# EasyEDA Pro project ProPrj_MaNFCKeyRing_2026-02-08.epro

# Board MaKeyRing
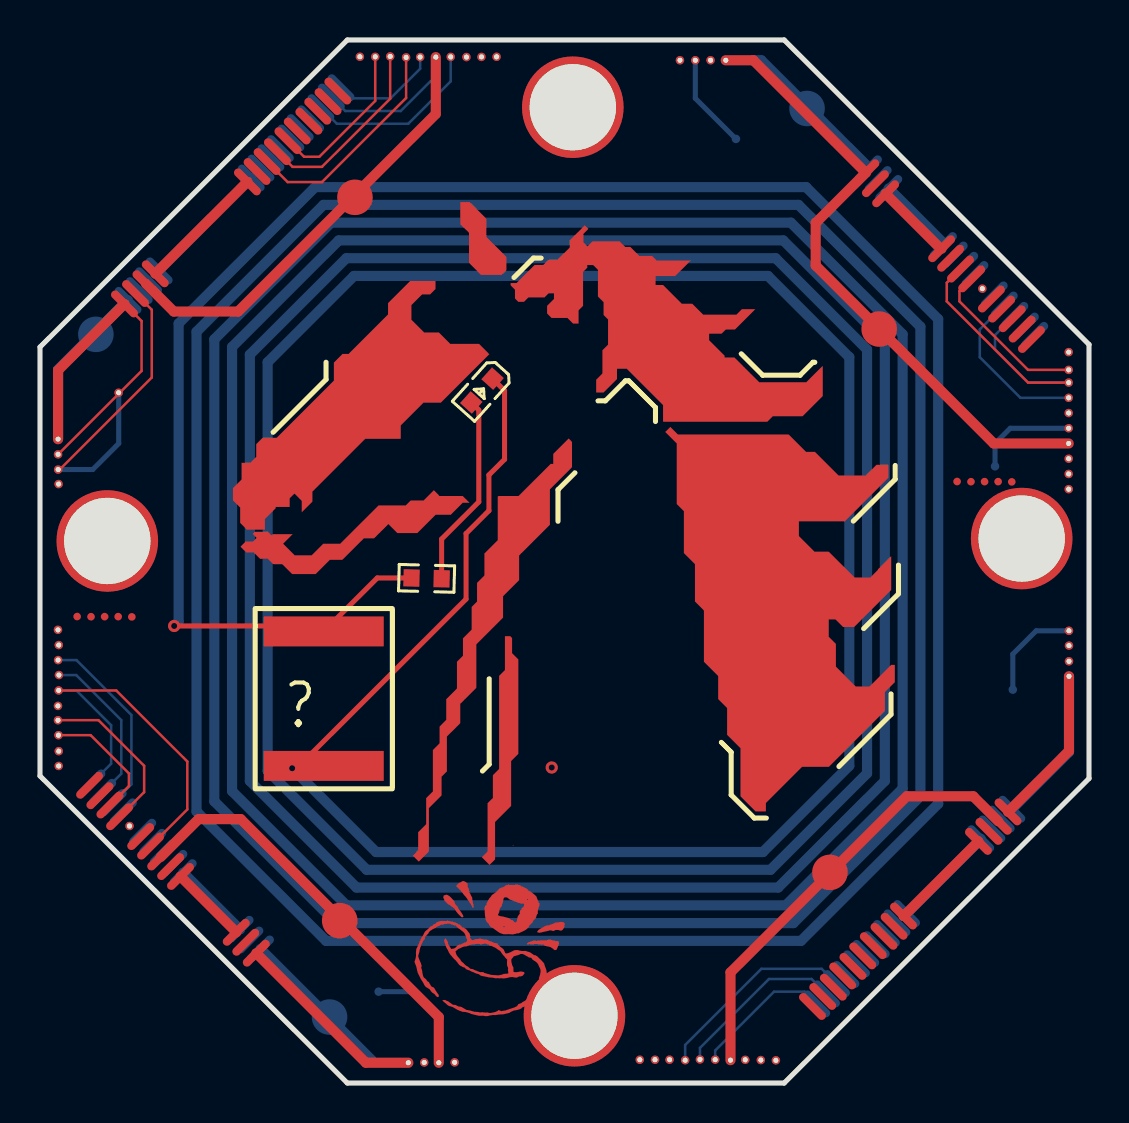
[diagram p0: board, top side]
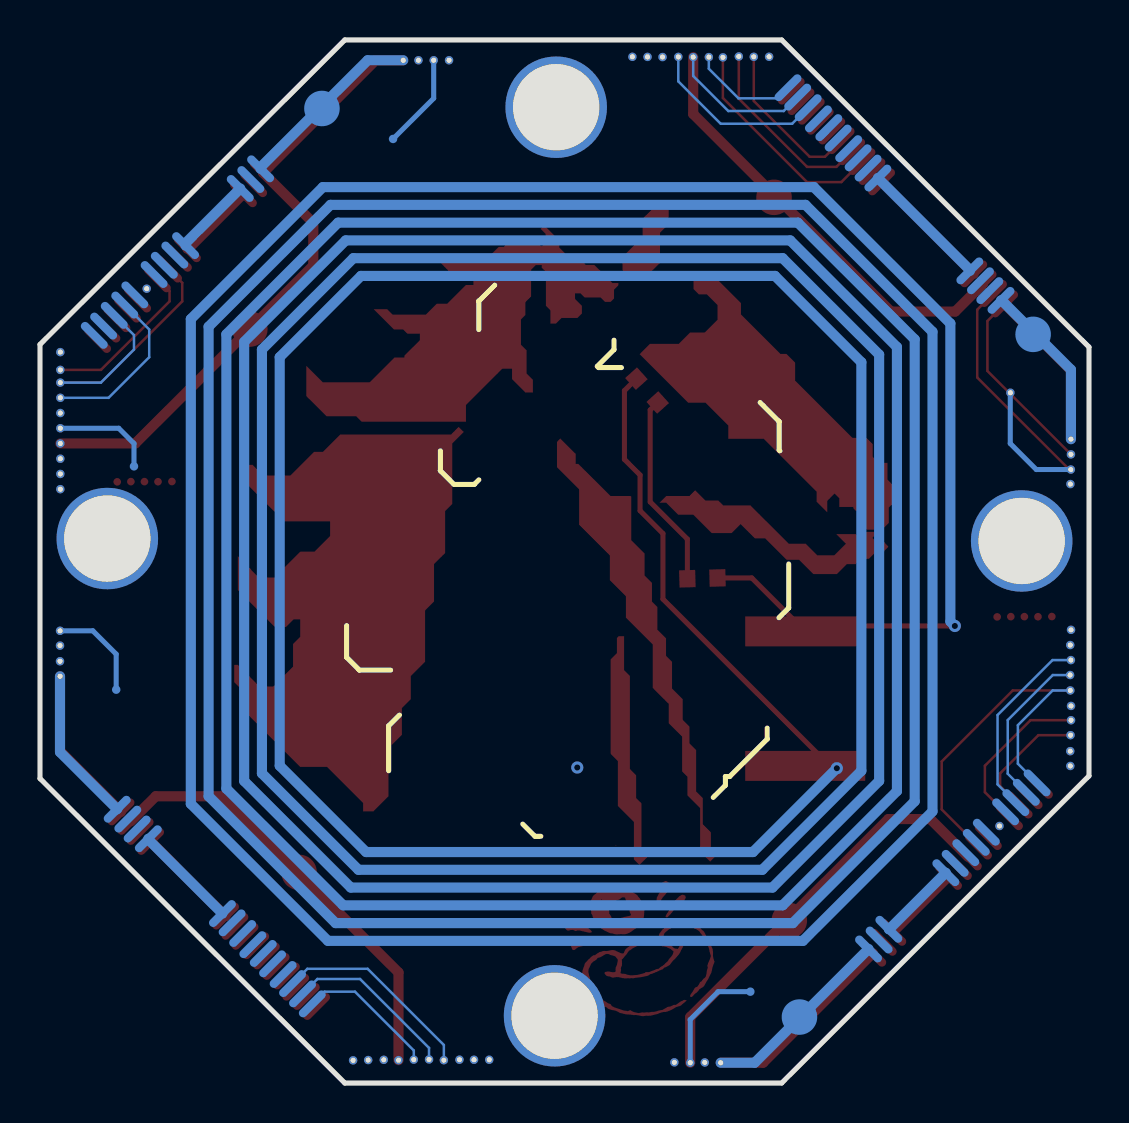
[diagram p1: board, bottom side, seen from below]

Outline 52.45 x 52.2 mm; copper layers: Top Layer, Bottom Layer. Coordinates in mm from the lower left corner of the outline.
Outline path: 0,36.83 15.37,52.2 37.21,52.2 52.45,36.96 52.45,15.24 37.21,0 15.37,0 0,15.37 0,36.83
Stack: Top Layer 0.035mm / Dielectric1 1.51mm FR4 er 4.5 / Bottom Layer 0.035mm

## Design rules (mm)
spacing copperThickness1oz (default): track to track 0.102, other pairs 0.152 to 0.3
spacing copperThickness2oz: track to track 0.203, other pairs 0.152 to 0.3
spacing Plane_innerPlane: track to track 0.102, other pairs 0.152 to 0.3
spacing Copper_copperRegion: track to track 0.102, other pairs 0.152 to 0.3
track width copperThickness1oz (default): min 0.127, default 0.254, max 2.54
track width copperThickness2oz: min 0.203, default 0.254, max 2.54
differential pair differentialPair (default): width min 0.127, default 0.254, max 2.54; gap min 0.152, default 0.152

## Placement (name value [footprint] x y rotation side)
LED1  NCD0603R1  [LED0603-RD_RED]  22.1 34.65 228 top
NOREF  -  [Pad_e176]  35.26 1.16 45 top
NOREF#2  -  [Pad_e13]  2.48 14.9 135 top
NOREF#3  -  [Pad_e131]  48.59 13.7 45 top
NOREF#4  -  [Pad_e66]  47.23 30.1 45 top
NOREF#5  -  [Pad_e20]  4.22 38.99 45 top
NOREF#6  -  [Pad_e139]  0.9 31.46 45 top
NOREF#7  -  [Pad_e60]  45.53 41.27 315 top
NOREF#8  -  [Pad_e33]  10.81 6.5 135 top
NOREF#9  -  [Pad_e105]  14.48 3.3 45 top
NOREF#10  -  [Pad_e22]  4.78 39.51 45 top
NOREF#11  -  [Pad_e16]  3.23 23.34 45 top
NOREF#12  -  [Pad_e157]  19.21 1.03 45 top
NOREF#13  -  [Pad_e68]  47.57 39.23 315 top
NOREF#14  -  [Pad_e171]  33 1.18 45 top
NOREF#15  -  [Pad_e196]  37.15 23.21 0 top
NOREF#16  -  [Pad_e191]  51.45 21.11 45 top
NOREF#17  -  [Pad_e159]  19.94 1.02 45 top
NOREF#18  -  [Pad_e115]  41.42 45.75 135 top
NOREF#19  -  [Pad_e118]  42.32 7.48 45 top
NOREF#20  -  [Pad_e162]  21.32 51.34 45 top
NOREF#21  -  [Pad_e158]  19.79 51.34 45 top
NOREF#22  -  [Pad_e30]  9.81 7.54 135 top
NOREF#23  -  [Pad_e72]  48.4 13.57 45 top
NOREF#24  -  [Pad_e55]  42.2 7.34 45 top
NOREF#25  -  [Pad_e99]  11.54 46.3 45 top
NOREF#26  -  [Pad_e42]  14.89 49.64 45 top
NOREF#27  -  [Pad_e145]  0.93 15.87 45 top
NOREF#28  -  [Pad_e192]  51.45 20.35 45 top
NOREF#29  -  [Pad_e8]  34.8 47.24 45 top
NOREF#30  -  [Pad_e57]  42.71 7.84 45 top
NOREF#31  -  [Pad_e25]  5.53 11.86 135 top
NOREF#32  -  [Pad_e179]  47.12 39.75 45 top
NOREF#33  -  [Pad_e97]  11.02 6.71 135 top
NOREF#34  -  [Pad_e199]  16.06 34.57 0 top
NOREF#35  -  [Pad_e135]  0.9 22.68 45 top
NOREF#36  -  [Pad_e124]  46.24 40.92 135 top
NOREF#37  -  [Pad_e26]  5.76 40.5 45 top
NOREF#38  -  [Pad_e82]  3.13 14.55 135 top
NOREF#39  -  [Pad_e27]  6.03 11.31 135 top
NOREF#40  -  [Pad_e41]  14.4 49.11 45 top
NOREF#41  -  [Pad_e153]  17.51 51.37 45 top
NOREF#42  -  [Pad_e184]  51.44 35.69 45 top
NOREF#43  -  [Pad_e34]  10.86 45.61 45 top
NOREF#44  -  [Pad_e11]  16.93 4.57 45 top
NOREF#45  -  [Pad_e193]  51.45 21.89 45 top
NOREF#46  -  [Pad_e187]  51.44 31.24 45 top
NOREF#47  -  [Pad_e89]  5.64 12.05 135 top
NOREF#48  -  [Pad_e6]  26.64 48.83 45 top
NOREF#49  -  [Pad_e200]  15.76 27.28 0 top
NOREF#50  -  [Pad_e108]  38.35 48.77 45 top
NOREF#51  -  [Pad_e53]  41.67 6.87 45 top
NOREF#52  -  [Pad_e28]  6.53 10.83 135 top
NOREF#53  -  [Pad_e69]  47.91 30.1 45 top
NOREF#54  -  [Pad_e123]  45.71 41.44 135 top
NOREF#55  -  [Pad_e24]  5.3 40 45 top
NOREF#56  -  [Pad_e169]  32.26 1.14 45 top
NOREF#57  -  [Pad_e137]  0.9 18.87 45 top
NOREF#58  -  [Pad_e86]  4.96 39.65 45 top
NOREF#59  -  [Pad_e185]  51.44 36.58 45 top
NOREF#60  -  [Pad_e168]  32 51.18 45 top
NOREF#61  -  [Pad_e70]  47.91 13.1 45 top
NOREF#62  -  [Pad_e10]  48.64 19.69 45 top
NOREF#63  -  [Pad_e173]  33.76 1.17 45 top
NOREF#64  -  [Pad_e101]  12.54 47.29 45 top
NOREF#65  -  [Pad_e23]  5.04 12.33 135 top
NOREF#66  -  [Pad_e134]  49.74 37.41 135 top
NOREF#67  -  [Pad_e17]  3.5 13.91 135 top
NOREF#68  -  [Pad_e194]  21.93 42.26 0 top
NOREF#69  -  [Pad_e84]  4.17 13.57 135 top
NOREF#70  -  [Pad_e188]  51.44 30.48 45 top
NOREF#71  -  [Pad_e136]  0.9 18.16 45 top
NOREF#72  -  [Pad_e190]  51.45 22.63 45 top
NOREF#73  -  [Pad_e167]  31.48 1.17 45 top
NOREF#74  -  [Pad_e15]  3 14.38 135 top
NOREF#75  -  [Pad_e102]  13.01 47.81 45 top
NOREF#76  -  [Pad_e122]  45.17 41.91 135 top
NOREF#77  -  [Pad_e111]  39.82 4.98 45 top
NOREF#78  -  [Pad_e107]  15.05 49.81 45 top
NOREF#79  -  [Pad_e7]  3.37 27.13 135 top
NOREF#80  -  [Pad_e85]  4.4 39.17 45 top
NOREF#81  -  [Pad_e93]  7.16 10.53 135 top
NOREF#82  -  [Pad_e96]  10.56 45.29 45 top
NOREF#83  -  [Pad_e160]  20.53 51.35 45 top
NOREF#84  -  [Pad_e45]  38.62 3.83 45 top
NOREF#85  -  [Pad_e32]  10.37 45.09 45 top
NOREF#86  -  [Pad_e186]  51.44 32 45 top
NOREF#87  -  [Pad_e132]  48.74 38.42 135 top
NOREF#88  -  [Pad_e18]  3.91 23.34 45 top
NOREF#89  -  [Pad_e125]  46.75 40.46 135 top
NOREF#90  -  [Pad_e75]  49.11 37.73 315 top
NOREF#91  -  [Pad_e106]  14.57 49.34 45 top
NOREF#92  -  [Pad_e128]  47.71 39.44 135 top
NOREF#93  -  [Pad_e14]  2.55 23.33 45 top
NOREF#94  -  [Pad_e19]  3.98 13.33 135 top
NOREF#95  -  [Pad_e170]  32.77 51.18 45 top
NOREF#96  -  [Pad_e74]  48.61 38.25 315 top
NOREF#97  -  [Pad_e94]  10.01 7.69 135 top
NOREF#98  -  [Pad_e144]  0.93 19.65 45 top
NOREF#99  -  [Pad_e147]  0.94 21.92 45 top
NOREF#100  -  [Pad_e47]  39.5 10.54 45 top
NOREF#101  -  [Pad_e50]  40.65 5.84 45 top
NOREF#102  -  [Pad_e63]  46.55 30.09 45 top
NOREF#103  -  [Pad_e104]  14.04 48.81 45 top
NOREF#104  -  [Pad_e29]  7.03 10.34 135 top
NOREF#105  -  [Pad_e56]  42.28 44.5 315 top
NOREF#106  -  [Pad_e141]  0.91 30.7 45 top
NOREF#107  -  [Pad_e112]  40.3 5.43 45 top
NOREF#108  -  [Pad_e4]  26.72 3.37 225 top
NOREF#109  -  [Pad_e148]  0.95 20.42 45 top
NOREF#110  -  [Pad_e129]  48.06 13.21 45 top
NOREF#111  -  [Pad_e77]  41.96 37.73 45 top
NOREF#112  -  [Pad_e143]  0.93 29.97 45 top
NOREF#113  -  [Pad_e48]  39.67 4.8 45 top
NOREF#114  -  [Pad_e98]  11.05 45.79 45 top
NOREF#115  -  [Pad_e35]  11.35 46.11 45 top
NOREF#116  -  [Pad_e197]  23.44 16.64 0 top
NOREF#117  -  [Pad_e40]  13.89 48.63 45 top
NOREF#118  -  [Pad_e156]  19.01 51.34 45 top
NOREF#119  -  [Pad_e161]  20.73 1.03 45 top
NOREF#120  -  [Pad_e87]  5.13 12.55 135 top
NOREF#121  -  [Pad_e43]  14.99 8.13 45 top
NOREF#122  -  [Pad_e181]  51.44 33.53 45 top
NOREF#123  -  [Pad_e71]  48.08 38.73 315 top
NOREF#124  -  [Pad_e52]  41.29 45.55 315 top
NOREF#125  -  [Pad_e121]  43.33 8.48 45 top
NOREF#126  -  [Pad_e80]  2.59 15.02 135 top
NOREF#127  -  [Pad_e140]  0.91 21.16 45 top
NOREF#128  -  [Pad_e180]  51.44 32.77 45 top
NOREF#129  -  [Pad_e109]  38.84 3.96 45 top
NOREF#130  -  [Pad_e150]  4.48 12.86 45 top
NOREF#131  -  [Pad_e58]  43.18 8.36 45 top
NOREF#132  -  [Pad_e88]  5.43 40.15 45 top
NOREF#133  -  [Pad_e65]  46.92 12.09 45 top
NOREF#134  -  [Pad_e166]  30.75 1.17 45 top
NOREF#135  -  [Pad_e100]  12.02 46.76 45 top
NOREF#136  -  [Pad_e152]  16.76 51.35 45 top
NOREF#137  -  [Pad_e83]  3.66 14.03 135 top
NOREF#138  -  [Pad_e49]  40.13 5.36 45 top
NOREF#139  -  [Pad_e198]  21.48 21.67 0 top
NOREF#140  -  [Pad_e149]  3.93 34.54 45 top
NOREF#141  -  [Pad_e73]  48.59 30.08 45 top
NOREF#142  -  [Pad_e110]  39.32 4.46 45 top
NOREF#143  -  [Pad_e59]  45.08 41.75 315 top
NOREF#144  -  [Pad_e163]  22.07 51.35 45 top
NOREF#145  -  [Pad_e138]  0.9 32.22 45 top
NOREF#146  -  [Pad_e113]  40.82 5.96 45 top
NOREF#147  -  [Pad_e172]  33.53 51.18 45 top
NOREF#148  -  [Pad_e78]  14.19 15.87 180 top
NOREF#149  -  [Pad_e182]  51.44 34.29 45 top
NOREF#150  -  [Pad_e90]  5.96 40.64 45 top
NOREF#151  -  [Pad_e61]  45.86 30.1 45 top
NOREF#152  -  [Pad_e174]  34.29 51.18 45 top
NOREF#153  -  [Pad_e114]  41.29 6.48 45 top
NOREF#154  -  [Pad_e39]  13.44 48.13 45 top
NOREF#155  -  [Pad_e151]  16 51.36 45 top
NOREF#156  -  [Pad_e130]  48.21 38.93 135 top
NOREF#157  -  [Pad_e183]  51.44 35.05 45 top
NOREF#158  -  [Pad_e64]  46.58 40.24 315 top
NOREF#159  -  [Pad_e38]  12.86 47.64 45 top
NOREF#160  -  [Pad_e91]  6.16 11.53 135 top
NOREF#161  -  [Pad_e116]  41.81 6.92 45 top
NOREF#162  -  [Pad_e92]  6.69 10.99 135 top
NOREF#163  -  [Pad_e126]  47.03 12.23 45 top
NOREF#164  -  [Pad_e81]  2.79 37.47 45 top
NOREF#165  -  [Pad_e46]  39.14 4.33 45 top
NOREF#166  -  [Pad_e165]  29.99 1.17 45 top
NOREF#167  -  [Pad_e154]  18.31 51.33 45 top
NOREF#168  -  [Pad_e117]  41.91 45.21 135 top
NOREF#169  -  [Pad_e36]  11.87 46.61 45 top
NOREF#170  -  [Pad_e21]  4.59 23.33 45 top
NOREF#171  -  [Pad_e44]  15.75 44.32 45 top
NOREF#172  -  [Pad_e189]  51.44 29.72 45 top
NOREF#173  -  [Pad_e67]  47.45 12.59 45 top
NOREF#174  -  [Pad_e103]  13.53 48.25 45 top
NOREF#175  -  [Pad_e62]  46.02 40.73 315 top
NOREF#176  -  [Pad_e127]  47.59 12.71 45 top
NOREF#177  -  [Pad_e54]  41.77 45 315 top
NOREF#178  -  [Pad_e175]  34.53 1.14 45 top
NOREF#179  -  [Pad_e142]  0.92 17.41 45 top
NOREF#180  -  [Pad_e37]  12.4 47.16 45 top
NOREF#181  -  [Pad_e79]  14.19 22.6 180 top
NOREF#182  -  [Pad_e9]  47.75 30.86 45 top
NOREF#183  -  [Pad_e120]  42.84 8.02 45 top
NOREF#184  -  [Pad_e146]  0.94 16.61 45 top
NOREF#185  -  [Pad_e76]  49.57 37.21 315 top
NOREF#186  -  [Pad_e51]  41.14 6.36 45 top
NOREF#187  -  [Pad_e119]  42.44 44.77 135 top
NOREF#188  -  [Pad_e12]  1.86 23.34 45 top
NOREF#189  -  [Pad_e195]  31.33 40.77 0 top
NOREF#190  -  [Pad_e155]  18.41 1.02 45 top
NOREF#191  -  [Pad_e177]  36.04 1.15 45 top
NOREF#192  -  [Pad_e133]  49.27 37.88 135 top
NOREF#193  -  [Pad_e5]  49.09 27.25 315 top
NOREF#194  -  [Pad_e178]  36.8 1.14 45 top
NOREF#195  -  [Pad_e95]  10.49 7.16 135 top
NOREF#196  -  [Pad_e164]  22.83 51.35 45 top
NOREF#197  -  [Pad_e31]  10.29 7.04 135 top
R1  10kΩ  [R0603]  19.33 25.25 178.5 top

## Footprints (pads in the part's own frame, mm; a bottom-side part is the same pattern mirrored in y, then rotated)
LED0603-RD_RED
  rect 0.8x0.8 smd: 1(-0.8,-0.004) 2(0.8,0.004)
Pad_e4
  round 5.08 hole 4.318: 1(0,0)
Pad_e5
  round 5.08 hole 4.318: 1(0,0)
Pad_e6
  round 5.08 hole 4.318: 1(0,0)
Pad_e7
  round 5.08 hole 4.318: 1(0,0)
Pad_e8
  round 0.423 smd far side: 1(0,0)
Pad_e9
  round 0.423 smd far side: 1(0,0)
Pad_e10
  round 0.423 smd far side: 1(0,0)
Pad_e11
  round 0.423 smd far side: 1(0,0)
Pad_e12
  round 0.381 smd: 1(0,0)
Pad_e13
  oval 0.423x1.728 smd: 1(0,0)
Pad_e14
  round 0.381 smd: 1(0,0)
Pad_e15
  oval 0.423x1.728 smd: 1(0,0)
Pad_e16
  round 0.381 smd: 1(0,0)
Pad_e17
  oval 0.423x1.728 smd: 1(0,0)
Pad_e18
  round 0.381 smd: 1(0,0)
Pad_e19
  oval 0.423x1.728 smd: 1(0,0)
Pad_e20
  oval 0.423x1.728 smd: 1(0,0)
Pad_e21
  round 0.381 smd: 1(0,0)
Pad_e22
  oval 0.423x1.728 smd: 1(0,0)
Pad_e23
  oval 0.423x1.728 smd: 1(0,0)
Pad_e24
  oval 0.423x1.728 smd: 1(0,0)
Pad_e25
  oval 0.423x1.728 smd: 1(0,0)
Pad_e26
  oval 0.423x1.728 smd: 1(0,0)
Pad_e27
  oval 0.423x1.728 smd: 1(0,0)
Pad_e28
  oval 0.423x1.728 smd: 1(0,0)
Pad_e29
  oval 0.423x1.728 smd: 1(0,0)
Pad_e30
  oval 0.423x1.728 smd: 1(0,0)
Pad_e31
  oval 0.423x1.728 smd: 1(0,0)
Pad_e32
  oval 0.423x1.728 smd: 1(0,0)
Pad_e33
  oval 0.423x1.728 smd: 1(0,0)
Pad_e34
  oval 0.423x1.728 smd: 1(0,0)
Pad_e35
  oval 0.423x1.728 smd: 1(0,0)
Pad_e36
  oval 0.423x1.728 smd: 1(0,0)
Pad_e37
  oval 0.423x1.728 smd: 1(0,0)
Pad_e38
  oval 0.423x1.728 smd: 1(0,0)
Pad_e39
  oval 0.423x1.728 smd: 1(0,0)
Pad_e40
  oval 0.423x1.728 smd: 1(0,0)
Pad_e41
  oval 0.423x1.728 smd: 1(0,0)
Pad_e42
  oval 0.423x1.728 smd: 1(0,0)
Pad_e43
  round 1.778 smd: 1(0,0)
Pad_e44
  round 1.778 smd: 1(0,0)
Pad_e45
  oval 0.423x1.728 smd: 1(0,0)
Pad_e46
  oval 0.423x1.728 smd: 1(0,0)
Pad_e47
  round 1.778 smd: 1(0,0)
Pad_e48
  oval 0.423x1.728 smd: 1(0,0)
Pad_e49
  oval 0.423x1.728 smd: 1(0,0)
Pad_e50
  oval 0.423x1.728 smd: 1(0,0)
Pad_e51
  oval 0.423x1.728 smd: 1(0,0)
Pad_e52
  oval 0.423x1.728 smd: 1(0,0)
Pad_e53
  oval 0.423x1.728 smd: 1(0,0)
Pad_e54
  oval 0.423x1.728 smd: 1(0,0)
Pad_e55
  oval 0.423x1.728 smd: 1(0,0)
Pad_e56
  oval 0.423x1.728 smd: 1(0,0)
Pad_e57
  oval 0.423x1.728 smd: 1(0,0)
Pad_e58
  oval 0.423x1.728 smd: 1(0,0)
Pad_e59
  oval 0.423x1.728 smd: 1(0,0)
Pad_e60
  oval 0.423x1.728 smd: 1(0,0)
Pad_e61
  round 0.381 smd: 1(0,0)
Pad_e62
  oval 0.423x1.728 smd: 1(0,0)
Pad_e63
  round 0.381 smd: 1(0,0)
Pad_e64
  oval 0.423x1.728 smd: 1(0,0)
Pad_e65
  oval 0.423x1.728 smd: 1(0,0)
Pad_e66
  round 0.381 smd: 1(0,0)
Pad_e67
  oval 0.423x1.728 smd: 1(0,0)
Pad_e68
  oval 0.423x1.728 smd: 1(0,0)
Pad_e69
  round 0.381 smd: 1(0,0)
Pad_e70
  oval 0.423x1.728 smd: 1(0,0)
Pad_e71
  oval 0.423x1.728 smd: 1(0,0)
Pad_e72
  oval 0.423x1.728 smd: 1(0,0)
Pad_e73
  round 0.381 smd: 1(0,0)
Pad_e74
  oval 0.423x1.728 smd: 1(0,0)
Pad_e75
  oval 0.423x1.728 smd: 1(0,0)
Pad_e76
  oval 0.423x1.728 smd: 1(0,0)
Pad_e77
  round 1.778 smd: 1(0,0)
Pad_e78
  rect 6x1.5 smd: 1(0,0)
Pad_e79
  rect 6x1.5 smd: 1(0,0)
Pad_e80
  oval 0.423x1.728 smd far side: 1(0,0)
Pad_e81
  round 1.778 smd far side: 1(0,0)
Pad_e82
  oval 0.423x1.728 smd far side: 1(0,0)
Pad_e83
  oval 0.423x1.728 smd far side: 1(0,0)
Pad_e84
  oval 0.423x1.728 smd far side: 1(0,0)
Pad_e85
  oval 0.423x1.728 smd far side: 1(0,0)
Pad_e86
  oval 0.423x1.728 smd far side: 1(0,0)
Pad_e87
  oval 0.423x1.728 smd far side: 1(0,0)
Pad_e88
  oval 0.423x1.728 smd far side: 1(0,0)
Pad_e89
  oval 0.423x1.728 smd far side: 1(0,0)
Pad_e90
  oval 0.423x1.728 smd far side: 1(0,0)
Pad_e91
  oval 0.423x1.728 smd far side: 1(0,0)
Pad_e92
  oval 0.423x1.728 smd far side: 1(0,0)
Pad_e93
  oval 0.423x1.728 smd far side: 1(0,0)
Pad_e94
  oval 0.423x1.728 smd far side: 1(0,0)
Pad_e95
  oval 0.423x1.728 smd far side: 1(0,0)
Pad_e96
  oval 0.423x1.728 smd far side: 1(0,0)
Pad_e97
  oval 0.423x1.728 smd far side: 1(0,0)
Pad_e98
  oval 0.423x1.728 smd far side: 1(0,0)
Pad_e99
  oval 0.423x1.728 smd far side: 1(0,0)
Pad_e100
  oval 0.423x1.728 smd far side: 1(0,0)
Pad_e101
  oval 0.423x1.728 smd far side: 1(0,0)
Pad_e102
  oval 0.423x1.728 smd far side: 1(0,0)
Pad_e103
  oval 0.423x1.728 smd far side: 1(0,0)
Pad_e104
  oval 0.423x1.728 smd far side: 1(0,0)
Pad_e105
  round 1.778 smd far side: 1(0,0)
Pad_e106
  oval 0.423x1.728 smd far side: 1(0,0)
Pad_e107
  oval 0.423x1.728 smd far side: 1(0,0)
Pad_e108
  round 1.778 smd far side: 1(0,0)
Pad_e109
  oval 0.423x1.728 smd far side: 1(0,0)
Pad_e110
  oval 0.423x1.728 smd far side: 1(0,0)
Pad_e111
  oval 0.423x1.728 smd far side: 1(0,0)
Pad_e112
  oval 0.423x1.728 smd far side: 1(0,0)
Pad_e113
  oval 0.423x1.728 smd far side: 1(0,0)
Pad_e114
  oval 0.423x1.728 smd far side: 1(0,0)
Pad_e115
  oval 0.423x1.728 smd far side: 1(0,0)
Pad_e116
  oval 0.423x1.728 smd far side: 1(0,0)
Pad_e117
  oval 0.423x1.728 smd far side: 1(0,0)
Pad_e118
  oval 0.423x1.728 smd far side: 1(0,0)
Pad_e119
  oval 0.423x1.728 smd far side: 1(0,0)
Pad_e120
  oval 0.423x1.728 smd far side: 1(0,0)
Pad_e121
  oval 0.423x1.728 smd far side: 1(0,0)
Pad_e122
  oval 0.423x1.728 smd far side: 1(0,0)
Pad_e123
  oval 0.423x1.728 smd far side: 1(0,0)
Pad_e124
  oval 0.423x1.728 smd far side: 1(0,0)
Pad_e125
  oval 0.423x1.728 smd far side: 1(0,0)
Pad_e126
  oval 0.423x1.728 smd far side: 1(0,0)
Pad_e127
  oval 0.423x1.728 smd far side: 1(0,0)
Pad_e128
  oval 0.423x1.728 smd far side: 1(0,0)
Pad_e129
  oval 0.423x1.728 smd far side: 1(0,0)
Pad_e130
  oval 0.423x1.728 smd far side: 1(0,0)
Pad_e131
  oval 0.423x1.728 smd far side: 1(0,0)
Pad_e132
  oval 0.423x1.728 smd far side: 1(0,0)
Pad_e133
  oval 0.423x1.728 smd far side: 1(0,0)
Pad_e134
  oval 0.423x1.728 smd far side: 1(0,0)
Pad_e135
  round 0.423 hole 0.254: 1(0,0)
Pad_e136
  round 0.423 hole 0.254: 1(0,0)
Pad_e137
  round 0.423 hole 0.254: 1(0,0)
Pad_e138
  round 0.423 hole 0.254: 1(0,0)
Pad_e139
  round 0.423 hole 0.254: 1(0,0)
Pad_e140
  round 0.423 hole 0.254: 1(0,0)
Pad_e141
  round 0.423 hole 0.254: 1(0,0)
Pad_e142
  round 0.423 hole 0.254: 1(0,0)
Pad_e143
  round 0.423 hole 0.254: 1(0,0)
Pad_e144
  round 0.423 hole 0.254: 1(0,0)
Pad_e145
  round 0.423 hole 0.254: 1(0,0)
Pad_e146
  round 0.423 hole 0.254: 1(0,0)
Pad_e147
  round 0.423 hole 0.254: 1(0,0)
Pad_e148
  round 0.423 hole 0.254: 1(0,0)
Pad_e149
  round 0.423 hole 0.254: 1(0,0)
Pad_e150
  round 0.423 hole 0.254: 1(0,0)
Pad_e151
  round 0.423 hole 0.254: 1(0,0)
Pad_e152
  round 0.423 hole 0.254: 1(0,0)
Pad_e153
  round 0.423 hole 0.254: 1(0,0)
Pad_e154
  round 0.423 hole 0.254: 1(0,0)
Pad_e155
  round 0.423 hole 0.254: 1(0,0)
Pad_e156
  round 0.423 hole 0.254: 1(0,0)
Pad_e157
  round 0.423 hole 0.254: 1(0,0)
Pad_e158
  round 0.423 hole 0.254: 1(0,0)
Pad_e159
  round 0.423 hole 0.254: 1(0,0)
Pad_e160
  round 0.423 hole 0.254: 1(0,0)
Pad_e161
  round 0.423 hole 0.254: 1(0,0)
Pad_e162
  round 0.423 hole 0.254: 1(0,0)
Pad_e163
  round 0.423 hole 0.254: 1(0,0)
Pad_e164
  round 0.423 hole 0.254: 1(0,0)
Pad_e165
  round 0.423 hole 0.254: 1(0,0)
Pad_e166
  round 0.423 hole 0.254: 1(0,0)
Pad_e167
  round 0.423 hole 0.254: 1(0,0)
Pad_e168
  round 0.423 hole 0.254: 1(0,0)
Pad_e169
  round 0.423 hole 0.254: 1(0,0)
Pad_e170
  round 0.423 hole 0.254: 1(0,0)
Pad_e171
  round 0.423 hole 0.254: 1(0,0)
Pad_e172
  round 0.423 hole 0.254: 1(0,0)
Pad_e173
  round 0.423 hole 0.254: 1(0,0)
Pad_e174
  round 0.423 hole 0.254: 1(0,0)
Pad_e175
  round 0.423 hole 0.254: 1(0,0)
Pad_e176
  round 0.423 hole 0.254: 1(0,0)
Pad_e177
  round 0.423 hole 0.254: 1(0,0)
Pad_e178
  round 0.423 hole 0.254: 1(0,0)
Pad_e179
  round 0.423 hole 0.254: 1(0,0)
Pad_e180
  round 0.423 hole 0.254: 1(0,0)
Pad_e181
  round 0.423 hole 0.254: 1(0,0)
Pad_e182
  round 0.423 hole 0.254: 1(0,0)
Pad_e183
  round 0.423 hole 0.254: 1(0,0)
Pad_e184
  round 0.423 hole 0.254: 1(0,0)
Pad_e185
  round 0.423 hole 0.254: 1(0,0)
Pad_e186
  round 0.423 hole 0.254: 1(0,0)
Pad_e187
  round 0.423 hole 0.254: 1(0,0)
Pad_e188
  round 0.423 hole 0.254: 1(0,0)
Pad_e189
  round 0.423 hole 0.254: 1(0,0)
Pad_e190
  round 0.423 hole 0.254: 1(0,0)
Pad_e191
  round 0.423 hole 0.254: 1(0,0)
Pad_e192
  round 0.423 hole 0.254: 1(0,0)
Pad_e193
  round 0.423 hole 0.254: 1(0,0)
Pad_e194
  custom 2.309x3.645 smd: 3(0,0)
Pad_e195
  custom 15.605x9.834 smd: 4(0,0)
Pad_e196
  custom 11.486x19.243 smd: 5(0,0)
Pad_e197
  custom 1.829x11.451 smd: 6(0,0)
Pad_e198
  custom 7.963x21.172 smd: 7(0,0)
Pad_e199
  custom 12.827x12.444 smd: 8(0,0)
Pad_e200
  custom 11.441x4.194 smd: 10(0,0)
R0603
  rect 0.806x0.864 smd: 1(-0.753,0) 2(0.753,0)

## Nets
$1N256: LED1.2 R1.1
$1N261: LED1.1 NOREF#148.1 NOREF#181.1 R1.2

Pads without a net: NOREF 1; NOREF#2 1; NOREF#3 1; NOREF#4 1; NOREF#5 1; NOREF#6 1; NOREF#7 1; NOREF#8 1; NOREF#9 1; NOREF#10 1; NOREF#11 1; NOREF#12 1; NOREF#13 1; NOREF#14 1; NOREF#15 5; NOREF#16 1; NOREF#17 1; NOREF#18 1; NOREF#19 1; NOREF#20 1; NOREF#21 1; NOREF#22 1; NOREF#23 1; NOREF#24 1; NOREF#25 1; NOREF#26 1; NOREF#27 1; NOREF#28 1; NOREF#29 1; NOREF#30 1; NOREF#31 1; NOREF#32 1; NOREF#33 1; NOREF#34 8; NOREF#35 1; NOREF#36 1; NOREF#37 1; NOREF#38 1; NOREF#39 1; NOREF#40 1; NOREF#41 1; NOREF#42 1; NOREF#43 1; NOREF#44 1; NOREF#45 1; NOREF#46 1; NOREF#47 1; NOREF#48 1; NOREF#49 10; NOREF#50 1; NOREF#51 1; NOREF#52 1; NOREF#53 1; NOREF#54 1; NOREF#55 1; NOREF#56 1; NOREF#57 1; NOREF#58 1; NOREF#59 1; NOREF#60 1; NOREF#61 1; NOREF#62 1; NOREF#63 1; NOREF#64 1; NOREF#65 1; NOREF#66 1; NOREF#67 1; NOREF#68 3; NOREF#69 1; NOREF#70 1; NOREF#71 1; NOREF#72 1; NOREF#73 1; NOREF#74 1; NOREF#75 1; NOREF#76 1; NOREF#77 1; NOREF#78 1; NOREF#79 1; NOREF#80 1; NOREF#81 1; NOREF#82 1; NOREF#83 1; NOREF#84 1; NOREF#85 1; NOREF#86 1; NOREF#87 1; NOREF#88 1; NOREF#89 1; NOREF#90 1; NOREF#91 1; NOREF#92 1; NOREF#93 1; NOREF#94 1; NOREF#95 1; NOREF#96 1; NOREF#97 1; NOREF#98 1; NOREF#99 1; NOREF#100 1; NOREF#101 1; NOREF#102 1; NOREF#103 1; NOREF#104 1; NOREF#105 1; NOREF#106 1; NOREF#107 1; NOREF#108 1; NOREF#109 1; NOREF#110 1; NOREF#111 1; NOREF#112 1; NOREF#113 1; NOREF#114 1; NOREF#115 1; NOREF#116 6; NOREF#117 1; NOREF#118 1; NOREF#119 1; NOREF#120 1; NOREF#121 1; NOREF#122 1; NOREF#123 1; NOREF#124 1; NOREF#125 1; NOREF#126 1; NOREF#127 1; NOREF#128 1; NOREF#129 1; NOREF#130 1; NOREF#131 1; NOREF#132 1; NOREF#133 1; NOREF#134 1; NOREF#135 1; NOREF#136 1; NOREF#137 1; NOREF#138 1; NOREF#139 7; NOREF#140 1; NOREF#141 1; NOREF#142 1; NOREF#143 1; NOREF#144 1; NOREF#145 1; NOREF#146 1; NOREF#147 1; NOREF#149 1; NOREF#150 1; NOREF#151 1; NOREF#152 1; NOREF#153 1; NOREF#154 1; NOREF#155 1; NOREF#156 1; NOREF#157 1; NOREF#158 1; NOREF#159 1; NOREF#160 1; NOREF#161 1; NOREF#162 1; NOREF#163 1; NOREF#164 1; NOREF#165 1; NOREF#166 1; NOREF#167 1; NOREF#168 1; NOREF#169 1; NOREF#170 1; NOREF#171 1; NOREF#172 1; NOREF#173 1; NOREF#174 1; NOREF#175 1; NOREF#176 1; NOREF#177 1; NOREF#178 1; NOREF#179 1; NOREF#180 1; NOREF#182 1; NOREF#183 1; NOREF#184 1; NOREF#185 1; NOREF#186 1; NOREF#187 1; NOREF#188 1; NOREF#189 4; NOREF#190 1; NOREF#191 1; NOREF#192 1; NOREF#193 1; NOREF#194 1; NOREF#195 1; NOREF#196 1; NOREF#197 1

## Via types
v1: diameter 0.61, hole 0.305, Top Layer to Bottom Layer, 3 vias

## Routing (per net, layer and track width the routed paths; a pad name or vN(x,y) marks a point on that pad's centre or on a via; arc(x,y) is an arc through that point)
(no net): length 405.6
  Top Layer w0.127: NOREF#180.1 13.2,46.36 13.97,46.36 16.76,49.15 NOREF#136.1 ; NOREF#179.1 2.53,17.41 4.45,15.49 4.45,14.86 NOREF#67.1 ; NOREF#98.1 3.81,19.65 7.37,16.09 7.37,13.69 NOREF#31.1 ; NOREF#175.1 45.34,40.05 45.34,39.12 49.4,35.05 NOREF#157.1 ; NOREF#71.1 2.93,18.16 5.21,15.88 5.21,14.56 NOREF#94.1 ; NOREF#6.1 5.08,35.64 5.08,38.13 NOREF#5.1 ; NOREF#169.1 12.63,45.85 14.1,45.85 17.51,49.26 NOREF#41.1 ; NOREF#158.1 45.97,39.63 45.97,39.12 49.4,35.69 NOREF#42.1 ; NOREF#115.1 12.38,45.08 14.1,45.08 18.31,49.29 NOREF#167.1 ; NOREF#10.1 5.59,38.7 5.59,35.31 0.98,30.7 NOREF#106.1
  Top Layer w0.508: NOREF#21.1 19.79,48.49 9.91,38.61 6.69,38.61 NOREF#55.1 ; NOREF#104.1 9.81,7.55 NOREF#22.1 ; NOREF#85.1 10.36,45.09 NOREF#37.1 ; NOREF#86.1 47.69,32 NOREF#111.1 38.79,40.91 38.79,43.04 NOREF#124.1 35.67,51.18 NOREF#152.1 ; NOREF#178.1 34.53,5.53 43.34,14.35 46.66,14.35 NOREF#61.1 ; NOREF#28.1 51.45,16.62 NOREF#23.1 ; NOREF#131.1 43.19,8.36 NOREF#133.1 ; NOREF#145.1 0.9,35.67 NOREF#5.1 ; NOREF#105.1 45.03,41.75 NOREF#143.1 ; NOREF#8.1 16.3,1.02 NOREF#190.1 ; NOREF#17.1 19.94,3.3 10.03,13.21 7.93,13.21 NOREF#39.1
  Bottom Layer w0.127: NOREF#78.1 15.58,49.28 17.53,49.28 19.01,50.76 NOREF#118.1 ; NOREF#21.1 19.79,50.4 18.03,48.64 15.27,48.64 NOREF#91.1 ; NOREF#149.1 49.02,34.29 46.99,36.32 46.99,37.71 NOREF#156.1 ; NOREF#126.1 3.56,15.98 3.56,17.91 1.82,19.65 NOREF#98.1 ; NOREF#157.1 49.4,35.05 47.75,36.7 47.75,37.43 NOREF#87.1 ; NOREF#127.1 1.82,21.16 4.57,18.42 4.57,14.95 NOREF#137.1 ; NOREF#103.1 14.84,48.01 18.41,48.01 20.53,50.13 NOREF#83.1 ; NOREF#56.1 32.26,1.91 36.07,5.72 39.09,5.72 NOREF#77.1 ; NOREF#129.1 38.23,4.57 36.7,4.57 33.76,1.63 NOREF#63.1 ; NOREF#142.1 38.58,5.21 36.45,5.21 33,1.76 NOREF#14.1 ; NOREF#38.1 4.06,15.48 4.06,18.16 1.81,20.42 NOREF#109.1
  Bottom Layer w0.254: NOREF#128.1 48.51,32.77 47.75,32 NOREF#182.1 ; NOREF#17.1 19.94,3.17 18.54,4.57 NOREF#44.1 ; NOREF#95.1 32.77,49.28 NOREF#29.1 ; NOREF#62.1 48.64,21.46 49.81,22.63 NOREF#72.1 ; 3.94,34.54 3.94,32 2.63,30.7 NOREF#106.1
  Bottom Layer w0.508: NOREF#97.1 9.99,7.69 NOREF#81.1 ; NOREF#150.1 5.96,40.69 NOREF#82.1 ; NOREF#152.1 36.07,51.18 41.42,45.83 NOREF#18.1 ; NOREF#145.1 0.9,35.7 4.37,39.17 NOREF#80.1 ; NOREF#28.1 51.45,16.56 NOREF#3.1 ; NOREF#125.1 47.03,12.19 NOREF#163.1 ; NOREF#190.1 16.72,1.02 NOREF#33.1 ; NOREF#187.1 45.17,42.03 NOREF#76.1
  vias: v1(25.59,15.79)
$1N256: length 9.7
  Top Layer w0.254: R1.1 20.08,27.22 21.94,29.08 21.94,33.68 21.56,34.06
$1N261: length 749.1
  Top Layer w0.254: R1.2 16.86,25.27 NOREF#181.1 13.92,22.87 v1(6.71,22.87) ; LED1.1 23.23,34.65 23.23,31.21 22.45,30.43 22.45,28.64 21.3,27.5 21.3,24.22 12.84,15.75 v1(12.61,15.75)
  Bottom Layer w0.508: v1(6.71,22.87) 6.93,23.1 6.93,38.01 13.76,44.83 38.31,44.83 44.91,38.23 44.91,13.97 38.05,7.11 14.3,7.11 7.83,13.59 7.83,37.59 14.18,43.94 37.93,43.94 44.02,37.85 44.02,14.35 37.67,8 14.81,8 8.72,14.1 8.72,37.21 14.56,43.06 37.54,43.06 43.13,37.47 43.13,14.73 37.29,8.89 15.32,8.89 9.6,14.61 9.6,36.83 14.94,42.17 37.16,42.17 42.24,37.09 42.24,15.12 36.91,9.78 15.83,9.78 10.49,15.12 10.49,36.45 15.32,41.28 36.78,41.28 41.35,36.71 41.35,15.5 36.53,10.67 16.34,10.67 11.38,15.62 11.38,36.07 15.7,40.39 36.4,40.39 40.47,36.32 40.47,15.88 36.15,11.56 16.8,11.56 v1(12.61,15.75)

Small or netless copper shapes (teardrops, artwork), in the pictures only: 8 on Top Layer

## Text on the board
Top Silkscreen Layer: 🐎
